# EAGLE design Interface Adapter Mk.2 (EAGLE 6.1)

## Sheet 1 of 3
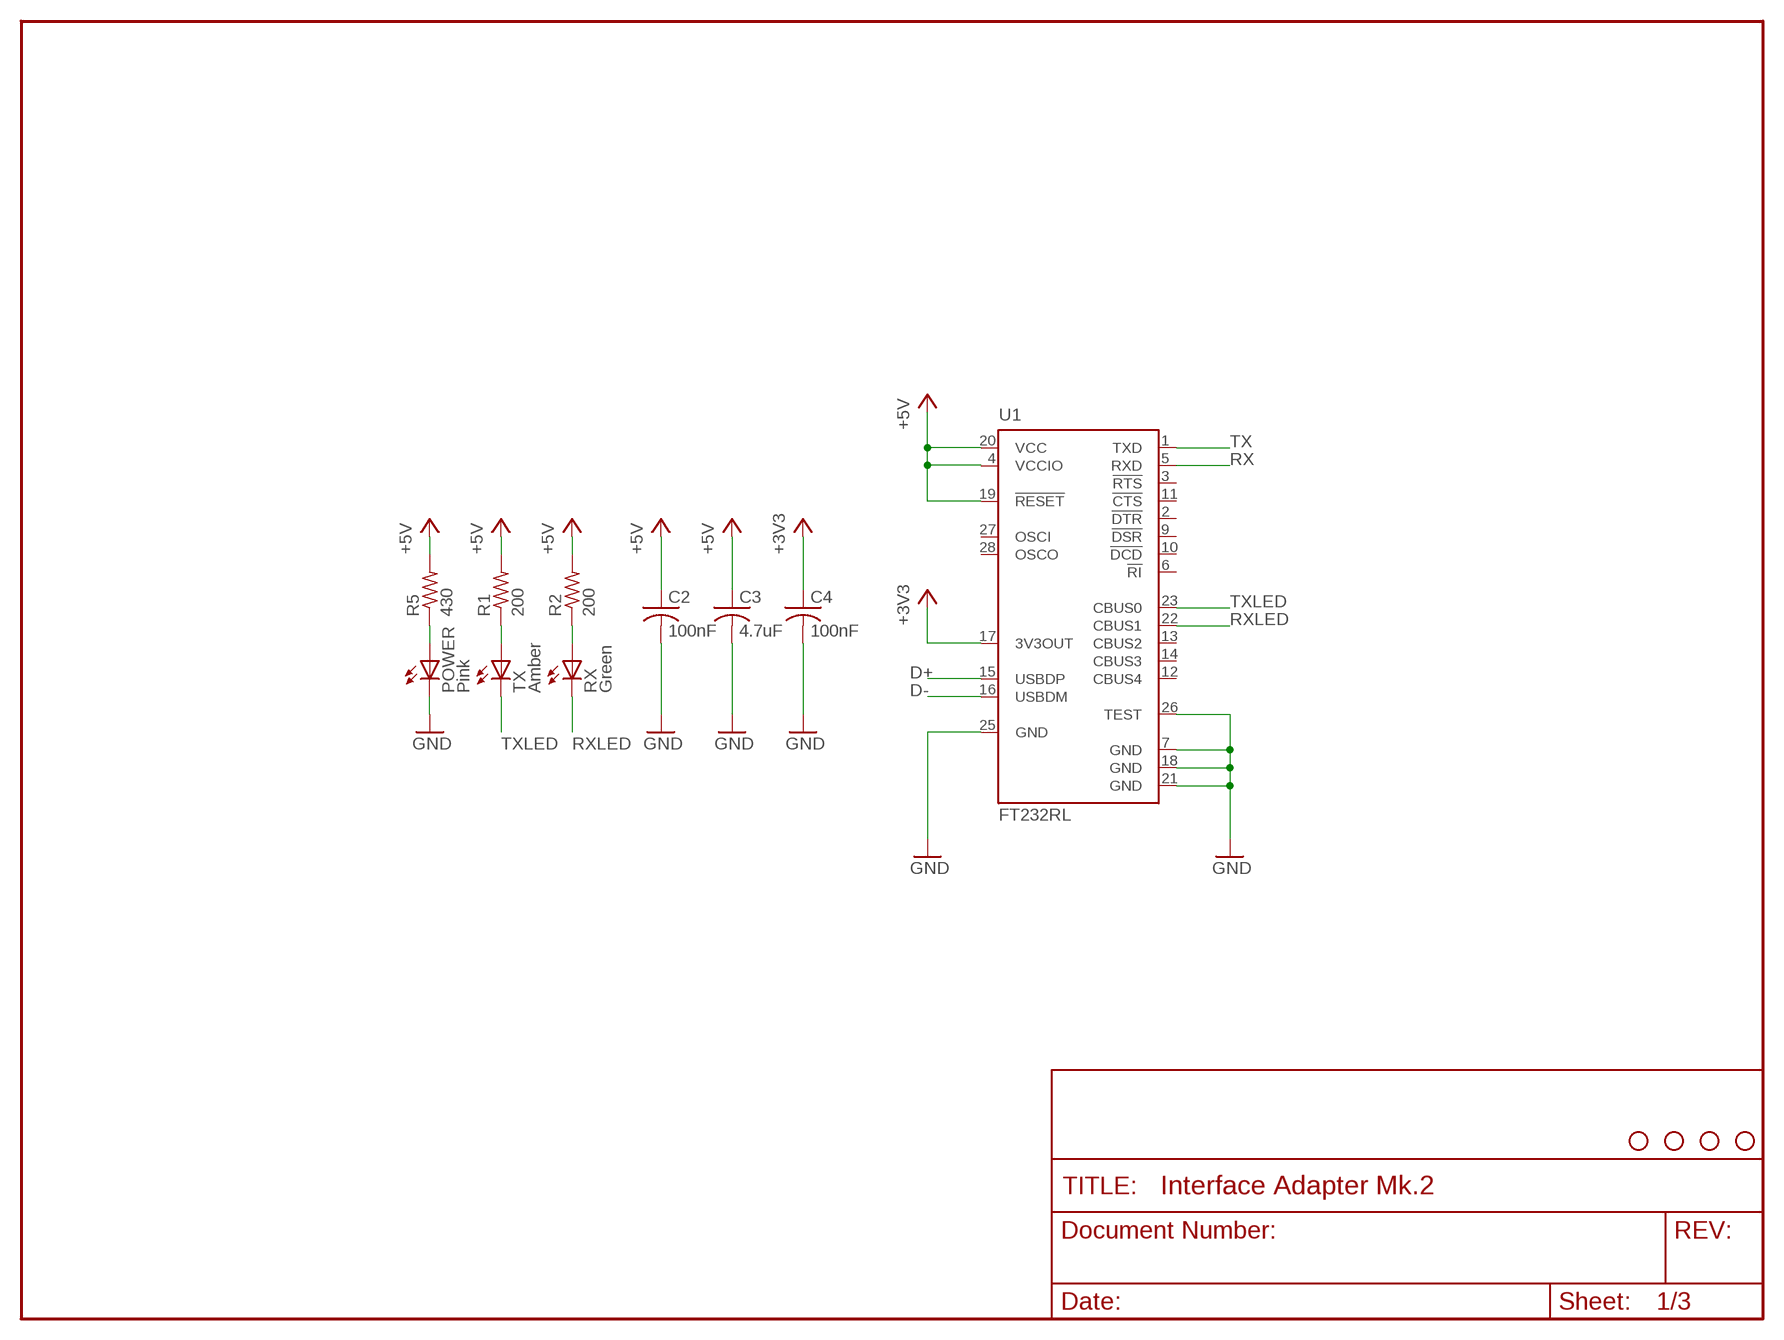
[diagram p0: schematic, sheet 1]

### Parts
C2  100nF  C-USC0603  [C0603]
C3  4.7uF  C-USC0603  [C0603]
C4  100nF  C-USC0603  [C0603]
JP1  STAND-OFF  [STAND-OFF]
JP2  STAND-OFF  [STAND-OFF]
JP3  STAND-OFF  [STAND-OFF]
JP4  STAND-OFF  [STAND-OFF]
POWER  Pink  LED0603  [LED-0603]
R1  200  R-US_R0603  [R0603]
R2  200  R-US_R0603  [R0603]
R5  430  R-US_R0603  [R0603]
RX  Green  LED0603  [LED-0603]
TX  Amber  LED0603  [LED-0603]
U1  FT232RL  [SSOP28]

### Nets
+3V3: C4.1 U1.17(3V3OUT)
+5V: C2.1 C3.1 R1.2 R2.2 R5.2 U1.4(VCCIO) U1.19(!RESET) U1.20(VCC) ; also sheet 2,3
D+: U1.15(USBDP) ; also sheet 3
D-: U1.16(USBDM) ; also sheet 3
GND: C2.2 C3.2 C4.2 POWER.C U1.7(GND) U1.18(GND) U1.21(GND) U1.25(GND) U1.26(TEST) ; also sheet 2,3
N$4: R1.1 TX.A
N$5: R2.1 RX.A
N$9: POWER.A R5.1
RX: U1.5(RXD) ; also sheet 2
RXLED: RX.C U1.22(CBUS1)
TX: U1.1(TXD) ; also sheet 2
TXLED: TX.C U1.23(CBUS0)
Unconnected: U1.2(!DTR) U1.3(!RTS) U1.6(!RI) U1.9(!DSR) U1.10(!DCD) U1.11(!CTS) U1.12(CBUS4) U1.13(CBUS2) U1.14(CBUS3) U1.27(OSCI) U1.28(OSCO)

## Sheet 2 of 3
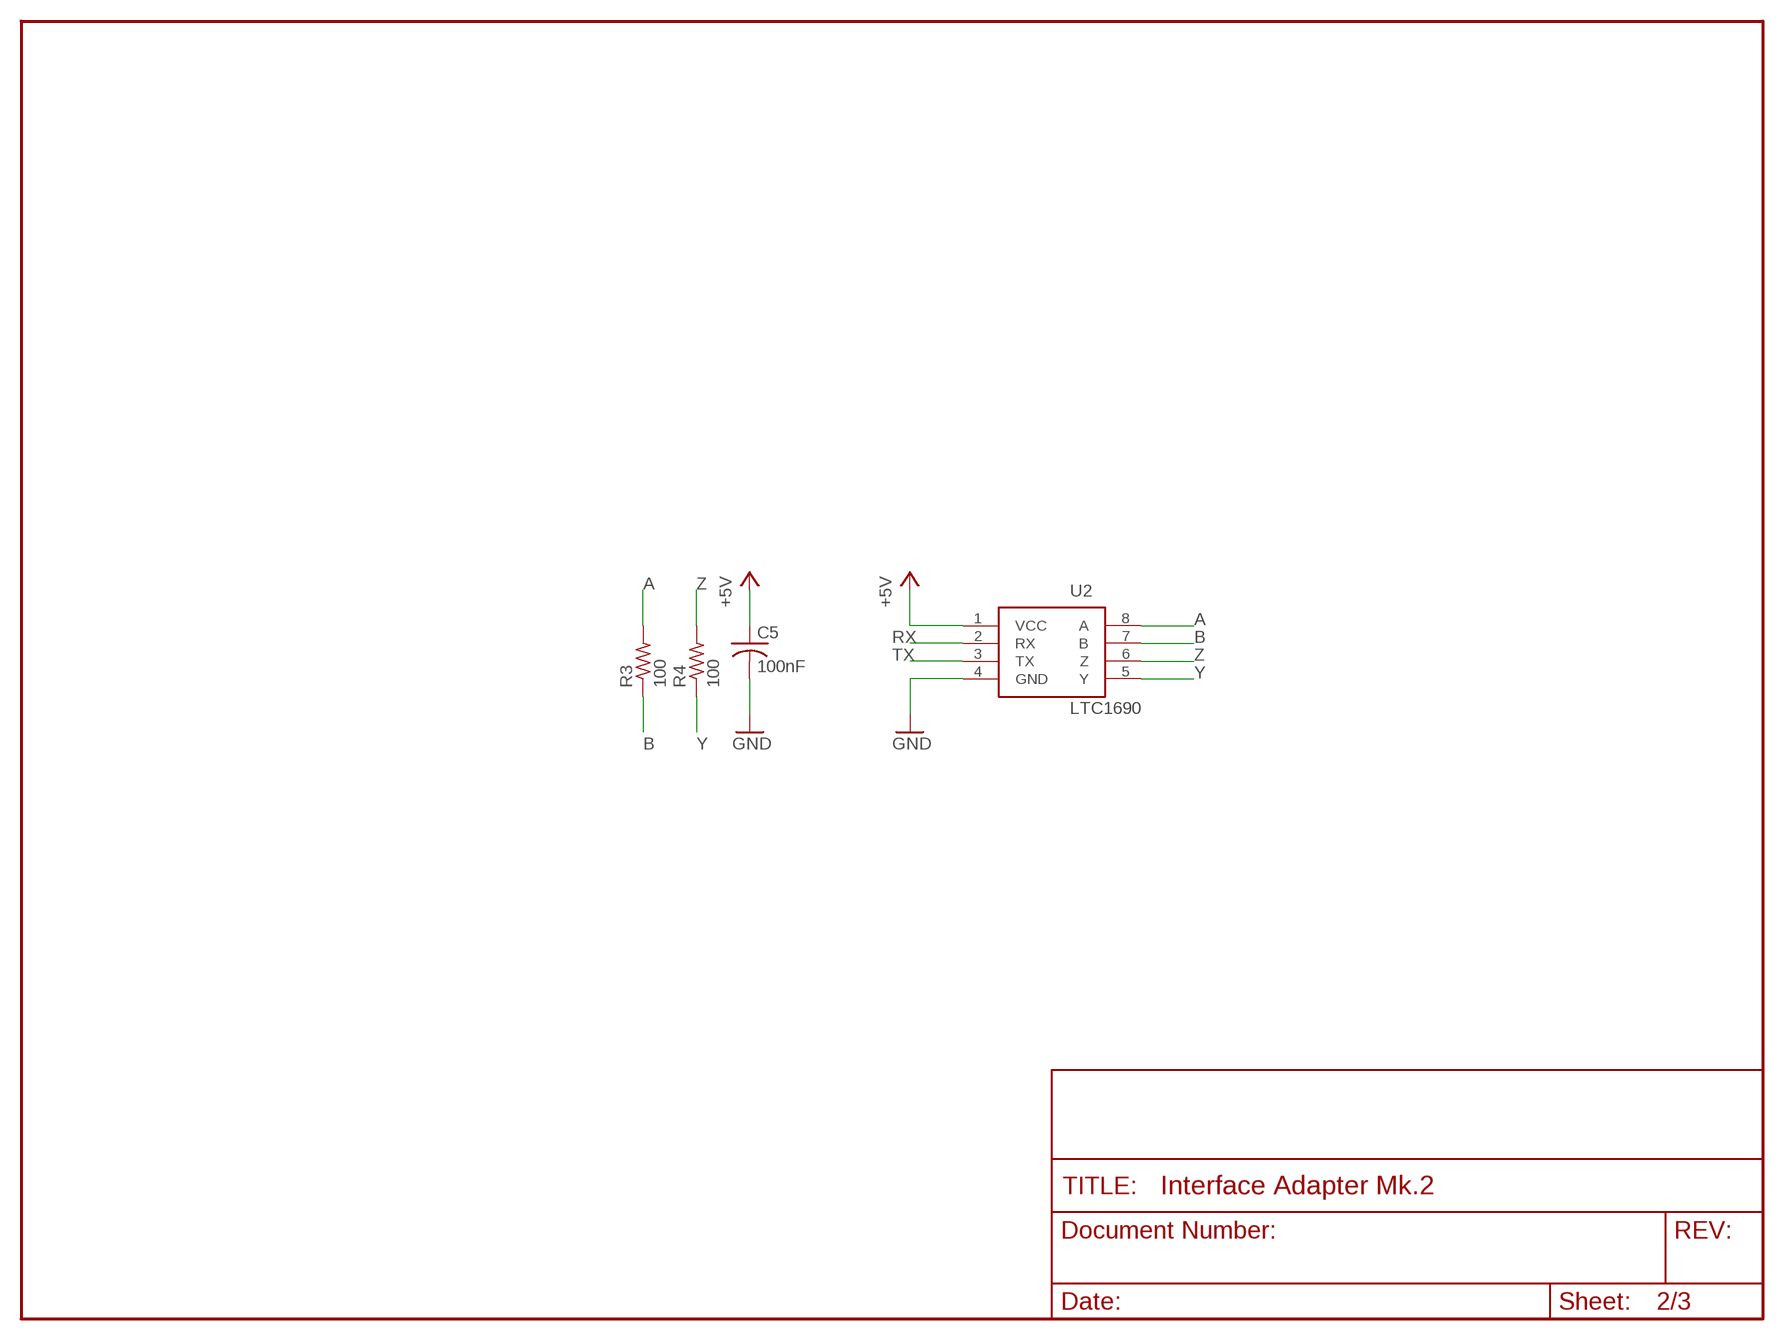
[diagram p1: schematic, sheet 2]

### Parts
C5  100nF  C-USC0603  [C0603]
R3  100  R-US_R0603  [R0603]
R4  100  R-US_R0603  [R0603]
U2  LTC1690  [SOIC-8]

### Nets
+5V: C5.1 U2.1(VCC) ; also sheet 1,3
A: R3.2 U2.8(A) ; also sheet 3
B: R3.1 U2.7(B) ; also sheet 3
GND: C5.2 U2.4(GND) ; also sheet 1,3
RX: U2.2(RX) ; also sheet 1
TX: U2.3(TX) ; also sheet 1
Y: R4.1 U2.5(Y) ; also sheet 3
Z: R4.2 U2.6(Z) ; also sheet 3

## Sheet 3 of 3
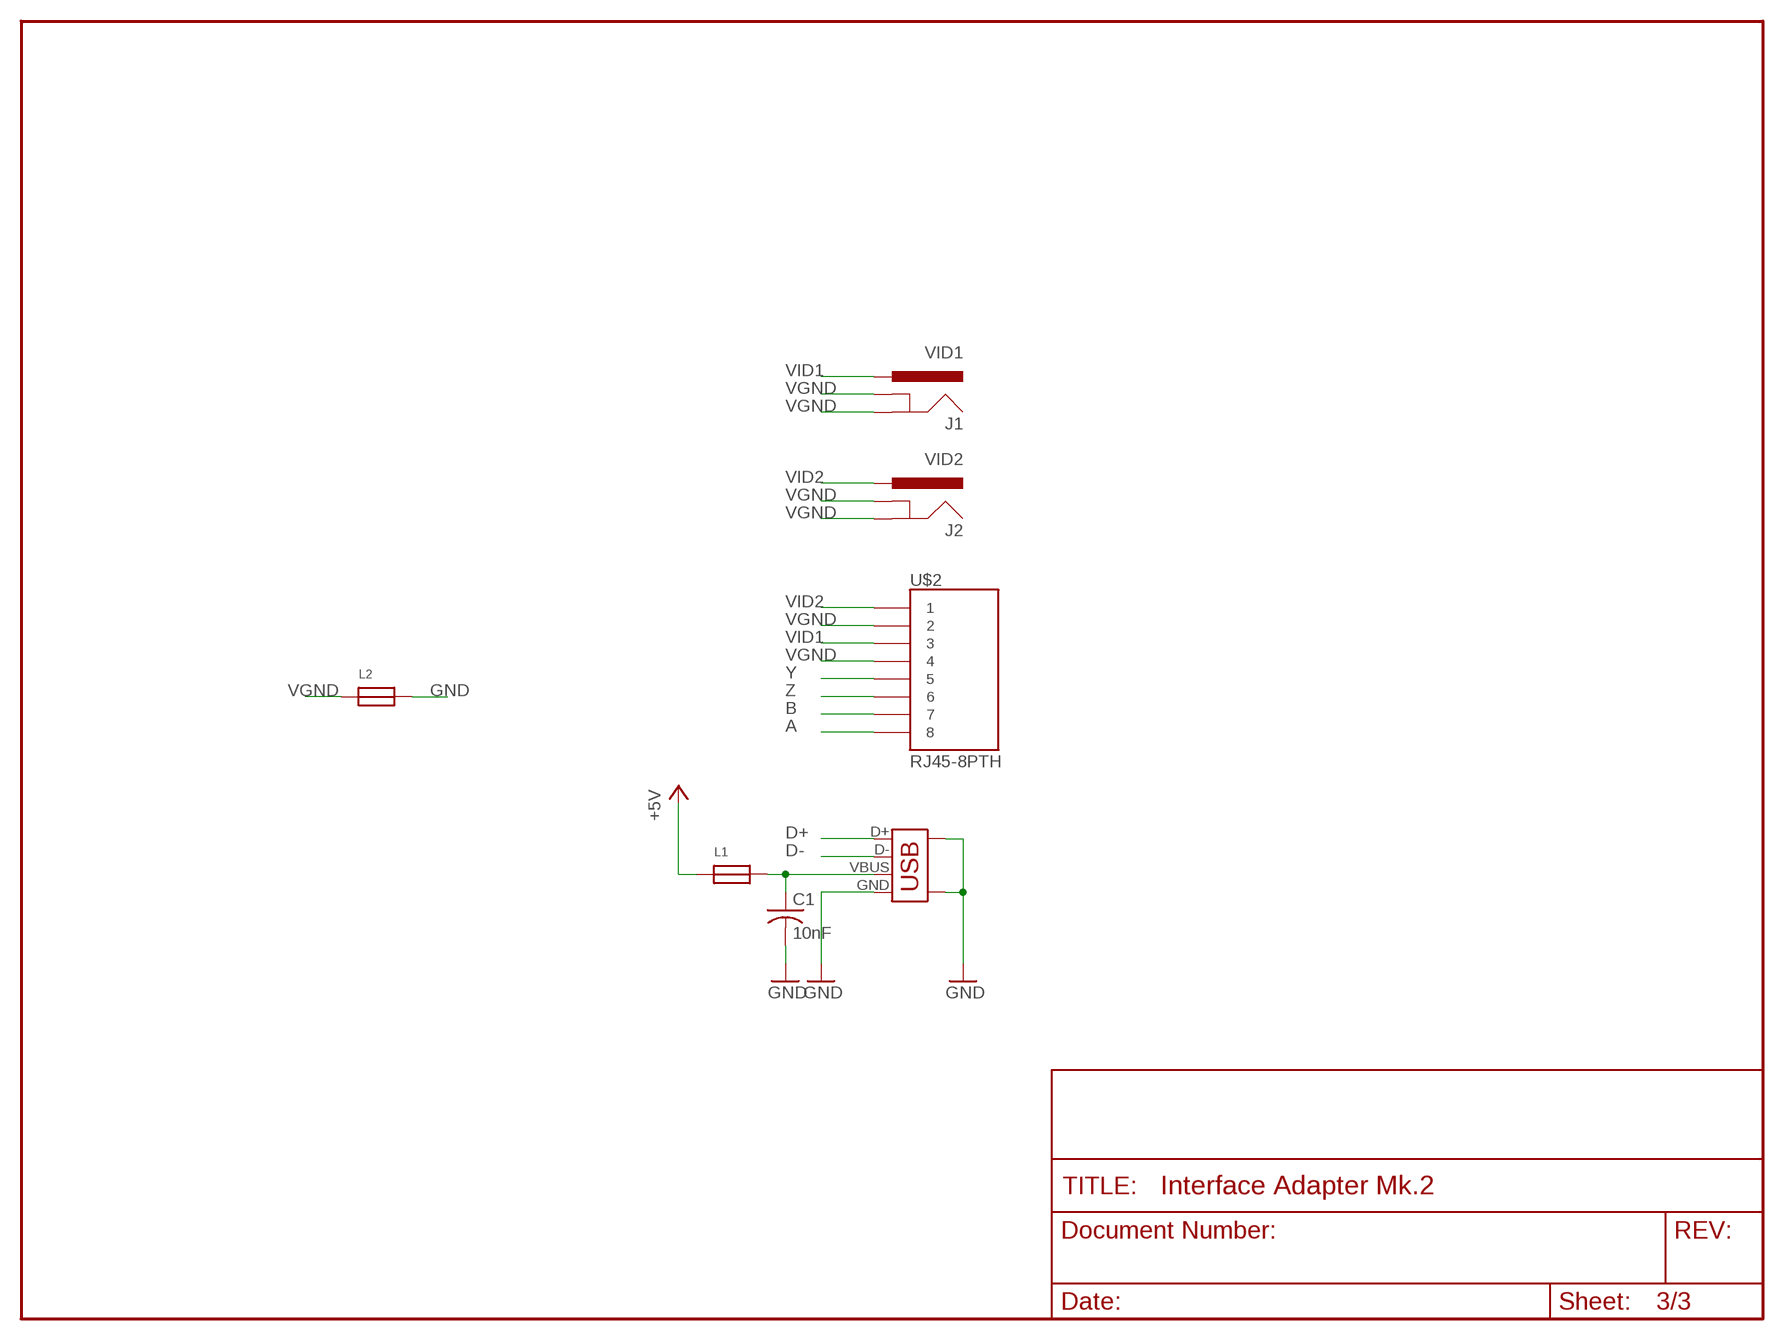
[diagram p2: schematic, sheet 3]

### Parts
C1  10nF  C-USC0603  [C0603]
J1  VID1  POWER_JACKRCA  [RCA]
J2  VID2  POWER_JACKRCA  [RCA]
L1  FERRITE  [0603]
L2  FERRITE  [0603]
U$2  RJ45-8PTH  [RJ45-8]
X1  USBPTH  [USB-B-PTH]

### Nets
+5V: L1.1 ; also sheet 1,2
A: U$2.8 ; also sheet 2
B: U$2.7 ; also sheet 2
D+: X1.D+ ; also sheet 1
D-: X1.D- ; also sheet 1
GND: C1.2 L2.2 X1.GND X1.P$1 X1.P$2 ; also sheet 1,2
N$1: C1.1 L1.2 X1.VBUS
VGND: J1.BARREL(GND) J1.SPRING(GNDBREAK) J2.BARREL(GND) J2.SPRING(GNDBREAK) L2.1 U$2.2 U$2.4
VID1: J1.BREAK(PWR) U$2.3
VID2: J2.BREAK(PWR) U$2.1
Y: U$2.5 ; also sheet 2
Z: U$2.6 ; also sheet 2

## Library data of the parts
C1-C5 = resistor:C-US: CAPACITOR, American symbol
J1 J2 = SparkFun:POWER_JACK: Power Jack This is the standard 5.5mm barrel jack for power. The PTH is the most common, proven, reliable, footprint. All others are experimental. The Slot footprint only works if the mill layer is transmitted to the PCB fab house so be warned. Spark Fun Electronics SKU : PRT-00119. Mating wall wart : TOL-00298 (and others)
JP1-JP4 = SparkFun:STAND-OFF: Stand Off This is the mechanical footprint for a #4 phillips button head screw. Use the keepout ring to avoid running the screw head into surrounding components. SKU : PRT-00447
L1 L2 = microbuilder:FERRITE: Ferrite Bead 0603 120 Ohm, 600mA Ferrite Chip - Digikey: 445-2164-1-ND
POWER RX TX = SparkFun:LED: LEDs Standard schematic elements and footprints for 5mm, 3mm, 1206, and 0603 sized LEDs. 5mm - Spark Fun Electronics SKU : COM-00529 (and others)
R1-R5 = resistor:R-US_: RESISTOR, American symbol
U1 = ftdichip:FT232R: Source: http://www.ftdichip.com/Documents/DataSheets/DS_FT232R_v104.pdf
U2 = Custom:LTC1690: Differential Driver and Receiver Pair with Fail-Safe Receiver Output
U$2 = SparkFun:RJ45-8: RJ45 Jack Simple RJ45, 8-pin connection - connector for common Cat5, Cat5e, and Cat6 Ethernet cables. Footprint not yet proven in production. Connector sku is PRT-00643; Breakout PCB sku is BOB-00716.
X1 = SparkFun:USB: USB Connectors USB-B-PTH is fully proven SKU : PRT-00139 USB-miniB is fully proven SKU : PRT-00587 USB-A-PCB is untested. USB-A-H is throughly reviewed, but untested. Spark Fun Electronics SKU : PRT-00437 USB-B-SMT is throughly reviewed, but untested. Needs silkscreen touching up. USB-A-S has not been used/tested USB-MB-H has not been used/tested

## Board
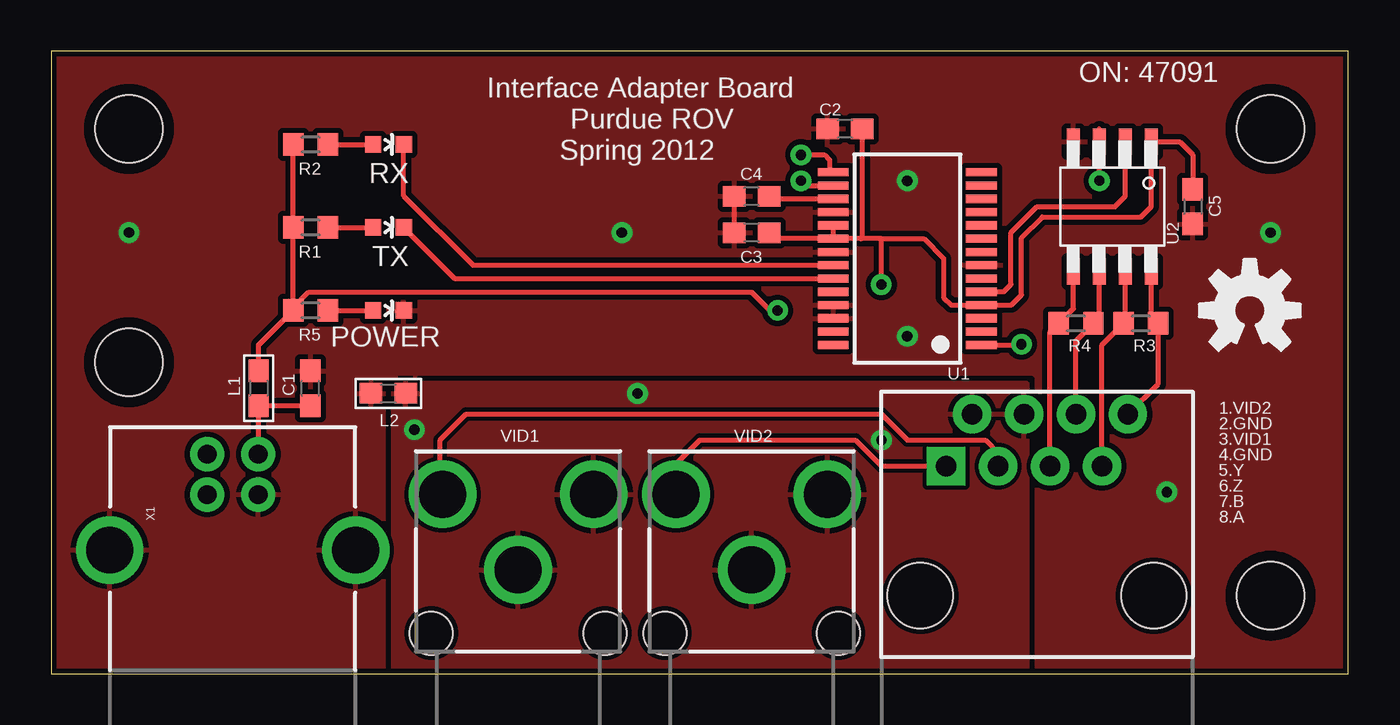
[diagram p3: board, top side]
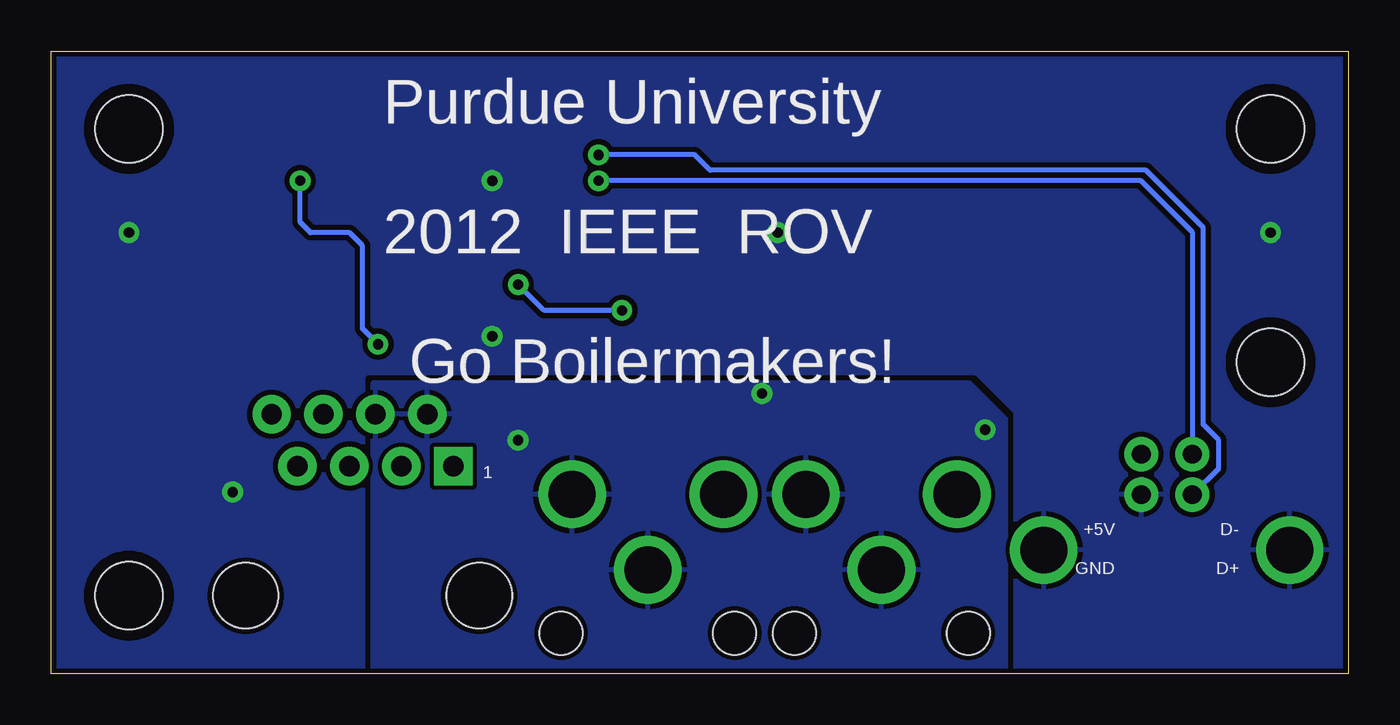
[diagram p4: board, bottom side, seen from below]

Size 63.5 x 30.48 mm. Coordinates in mm from the lower left corner, seen from the top.
Outline: 63.5,0 63.5,30.48 0,30.48 0,0 63.5,0
Copper layers (1*16): Top 0.035mm / dielectric 1.5mm / Bottom 0.035mm
Design rules: minimum track width 8mil, minimum drill 20mil, track to track 8mil, track to pad 8mil, pad to pad 8mil, via to via 8mil, smd to smd 8mil, copper to edge 10mil, drill to drill 8mil, minimum pad ring 12mil, minimum via ring 10mil, stop-mask expansion 4mil, vias tented up to drill 25mil, thermal gap 10mil

### Footprints (pad centres in the part's own frame; a part is rotated, then mirrored left to right if it is on the bottom)
C0603 = smd 1.1 x 1: 1 -0.85,0; 2 0.85,0
RCA = drill 2.3: BARREL 0,0; BREAK 3.7,3.7; SPRING 3.7,-3.7 | hole 2.1: -3.1,4.25; -3.1,-4.25
STAND-OFF = hole 3.302: 0,0
0603 = smd 1.1 x 1: 1 -0.85,0; 2 0.85,0
LED-0603 = smd 0.8 x 0.8: A 0,-0.75; C 0,0.75
R0603 = smd 1 x 1.1: 1 -0.85,0; 2 0.85,0
SSOP28 = smd 0.4 x 1.5: 1 -4.225,-3.625; 2 -3.575,-3.625; 3 -2.925,-3.625; 4 -2.275,-3.625; 5 -1.625,-3.625; 6 -0.975,-3.625; 7 -0.325,-3.625; 8 0.325,-3.625; 9 0.975,-3.625; 10 1.625,-3.625; 11 2.275,-3.625; 12 2.925,-3.625; 13 3.575,-3.625; 14 4.225,-3.625; 15 4.225,3.625; 16 3.575,3.625; 17 2.925,3.625; 18 2.275,3.625; 19 1.625,3.625; 20 0.975,3.625; 21 0.325,3.625; 22 -0.325,3.625; 23 -0.975,3.625; 24 -1.625,3.625; 25 -2.275,3.625; 26 -2.925,3.625; 27 -3.575,3.625; 28 -4.225,3.625
SOIC-8 = smd 1.27 x 0.635: 1 -3.175,1.778; 2 -3.175,0.508; 3 -3.175,-0.762; 4 -3.175,-2.032; 5 3.175,-2.032; 6 3.175,-0.762; 7 3.175,0.508; 8 3.175,1.778
RJ45-8 = drill 1 pad 1.88 square: 1 -4.445,6.35 | drill 1 pad 1.88: 2 -3.175,8.89; 3 -1.905,6.35; 4 -0.635,8.89; 5 0.635,6.35; 6 1.905,8.89; 7 3.175,6.35; 8 4.445,8.89 | hole 3.2: -5.715,0; 5.715,0
USB-B-PTH = drill 0.914 pad 1.676: D+ 0,1.25; D- 1.981,1.25; GND 0,-1.25; VBUS 1.981,-1.25 | drill 2.286: P$1 -2.718,-6.02; P$2 -2.718,6.02

### Placement (x,y rotation side)
C1  12.7,13.97 90 top
C2  38.86,26.67 180 top
C3  34.29,21.59 180 top
C4  34.29,23.37 180 top
C5  55.88,22.86 270 top
J1  22.86,5.08 90 top
J2  34.29,5.08 90 top
JP1  3.81,15.24 90 top
JP2  3.81,26.67 90 top
JP3  59.69,26.67 90 top
JP4  59.69,3.81 90 top
L1  10.16,13.97 270 top
L2  16.51,13.72 180 top
POWER  16.51,17.78 270 top
R1  12.7,21.84 180 top
R2  12.7,25.91 180 top
R3  53.34,17.14 0 top
R4  50.16,17.14 0 top
R5  12.7,17.78 180 top
RX  16.51,25.91 270 top
TX  16.51,21.84 270 top
U1  41.91,20.32 90 top
U2  52.07,22.86 270 top
U$1  [OSHW-LOGO-M]  58.67,17.78 0 top
U$2  48.26,3.81 0 top
X1  8.89,8.76 90 top

### Tracks (layer width: path | path; a pad name or v marks a point on that pad's centre or on a via)
+3V3
  Top 0.254: C4.1 35.26,23.25 U1.17
+5V  (via drill 0.5)
  Top 0.254: U1.20 35.44,21.3 C3.1 | 40.64,21.3 39.62,21.3 | 39.62,21.3 U1.20 | 40.64,21.3 42.71,21.3 43.69,20.32 43.69,18.41 44.07,18.03 45.52,18.03 U1.4 47,18.05 47.5,18.54 47.5,21.34 48.51,22.35 53.34,22.35 53.85,22.86 U2.1 55.24,26.04 55.88,25.4 C5.1 | v40.64,19.05 40.64,21.3 | U1.20 U1.19 | L1.1 10.16,16.09 R5.2 11.85,17.91 | 11.85,17.91 R1.2 R2.2 | v35.56,17.78 35.18,17.78 34.29,18.67 12.61,18.67 11.85,17.91 | C2.1 39.71,21.38 arc-90 39.62,21.3
  Bottom 0.254: v35.56,17.78 39.37,17.78 v40.64,19.05
A
  Top 0.254: U2.8 53.85,17.49 R3.2 54.19,14.19 U$2.8
B
  Top 0.254: U2.7 52.58,17.23 R3.1 51.44,16.09 U$2.7
D+  (via drill 0.5)
  Top 0.254: U1.15 38.1,24.73 38.1,25.15 37.85,25.4 v36.7,25.4
  Bottom 0.254: v36.7,25.4 32,25.4 31.24,24.64 9.91,24.64 7.11,21.84 7.11,12.19 6.35,11.43 6.35,10.05 X1.D+
D-  (via drill 0.5)
  Top 0.254: U1.16 36.94,23.89 v36.7,24.13
  Bottom 0.254: v36.7,24.13 10.16,24.13 7.62,21.59 7.62,10.76 X1.D-
GND  (via drill 0.51)
  Top 0.254: C3.2 C4.2
  other vias: 3.81,21.59 27.94,21.59 59.69,21.59 41.91,24.13 41.91,16.51 54.61,8.89
  pour Top (isolate 0.254, rank 2): 0.25,0.25 0.25,30.23 63.25,30.23 63.25,0.25
  pour Bottom (isolate 0.254, rank 2): 0.25,30.23 63.25,30.23 63.25,0.25 0.25,0.25
N$1
  Top 0.254: C1.1 L1.2 10.16,10.76 X1.VBUS
N$3  (via drill 0.5)
  other vias: 36.7,24.13
N$4
  Top 0.254: R1.1 TX.A
N$5
  Top 0.254: R2.1 RX.A
N$6  (via drill 0.5)
  other vias: 51.31,24.13
N$9
  Top 0.254: R5.1 POWER.A
N$11  (via drill 0.5)
  other vias: 40.64,19.05
RX
  Top 0.254: U1.5 46.63,18.7 46.99,19.05 46.99,21.59 48.26,22.86 52.07,22.86 52.58,23.37 U2.2
RXLED
  Top 0.254: U1.22 20.64,20 17.26,23.38 RX.C
TX  (via drill 0.5)
  Top 0.254: 51.31,26.67 U2.3 v51.31,24.13 | v47.5,16.13 47.46,16.09 U1.1
  Bottom 0.254: v51.31,24.13 51.31,22.1 50.8,21.59 48.9,21.59 48.26,20.95 48.26,16.89 v47.5,16.13
TXLED
  Top 0.254: TX.C 19.76,19.34 U1.23
VGND  (via drill 0.51)
  other vias: 17.78,11.94 28.7,13.72 40.64,11.43
  pour Top: 16.76,14.22 47.75,14.22 47.75,0.25 16.76,0.25
  pour Bottom: 18.54,14.22 47.75,14.22 47.75,0.25 16.76,0.25 16.76,12.45
VID1
  Top 0.254: U$2.3 46.35,10.79 45.72,11.43 41.91,11.43 40.64,12.7 20.32,12.7 19.05,11.43 19.05,8.89 J1.BREAK
VID2
  Top 0.254: U$2.1 40.64,10.16 39.37,11.43 31.75,11.43 30.48,10.16 30.48,8.89 J2.BREAK
Y
  Top 0.254: U2.5 50.04,17.87 R4.1 48.9,16.73 U$2.5
Z
  Top 0.254: U2.6 51.31,17.44 R4.2 50.16,16.3 U$2.6

### Text on the board
tPlace: ON: 47091 | Interface Adapter Board | Purdue ROV | Spring 2012 | 1.VID2 | VID1 | VID2 | 2.GND | 3.VID1 | 4.GND | 5.Y | 6.Z | 7.B | 8.A
bPlace: Purdue University | 2012 IEEE ROV | Go Boilermakers! | 1 | D- | +5V | D+ | GND